# Altium schematic sheet IDCI_WifiNode_CPU0.SchDoc
size A4
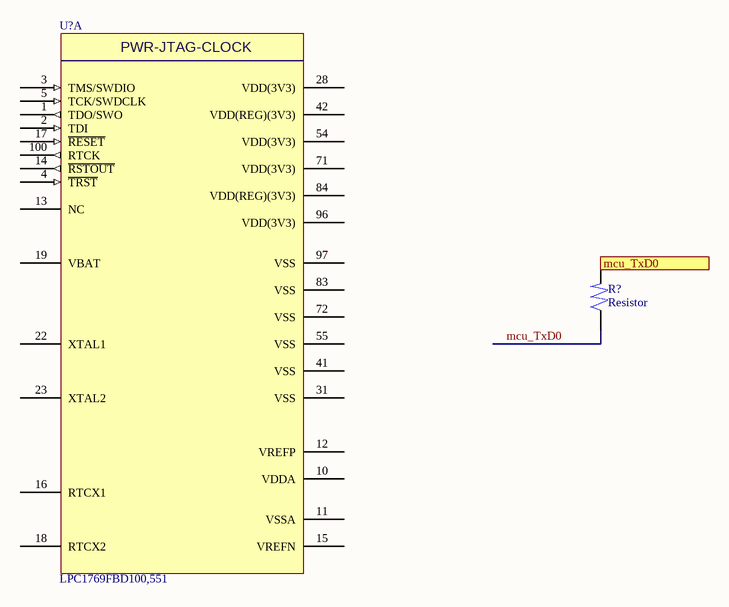
[diagram p0: IDCI_WifiNode_CPU0.SchDoc]

## Parts
R?  Resistor
U?  LPC1769FBD100,551  (part A of 4)

## Ports
mcu_TxD0 (in)

## Nets
mcu_TxD0: R?.47
mcu_TxD0: R?.48 ; port mcu_TxD0  [a separate net that carries the same name]

Not connected (* = marked no-connect by the designer): U? 1(TDO/SWO) 2(TDI) 3(TMS/SWDIO) 4(~{TRST}) 5(TCK/SWDCLK) 10(VDDA) 11(VSSA) 12(VREFP) 13(NC) 14(~{RSTOUT}) 15(VREFN) 16(RTCX1) 17(~{RESET}) 18(RTCX2) 19(VBAT) 22(XTAL1) 23(XTAL2) 28(VDD(3V3)) 31(VSS) 41(VSS) 42(VDD(REG)(3V3)) 54(VDD(3V3)) 55(VSS) 71(VDD(3V3)) 72(VSS) 83(VSS) 84(VDD(REG)(3V3)) 96(VDD(3V3)) 97(VSS) 100(RTCK)

## Notes on the sheet
- Title:
- Size:
- Author:
- A4
- Sheet
- of
- Revision:
- File:
- Date:
- (in symbol LPC1769FBD100_Multipart, part A) PWR-JTAG-CLOCK

## Library data of the parts
U? = LPC1769FBD100_Multipart: Mcu Cortex M3 LQFP100